# EAGLE schematic circuitdraft (EAGLE 9.5.1)
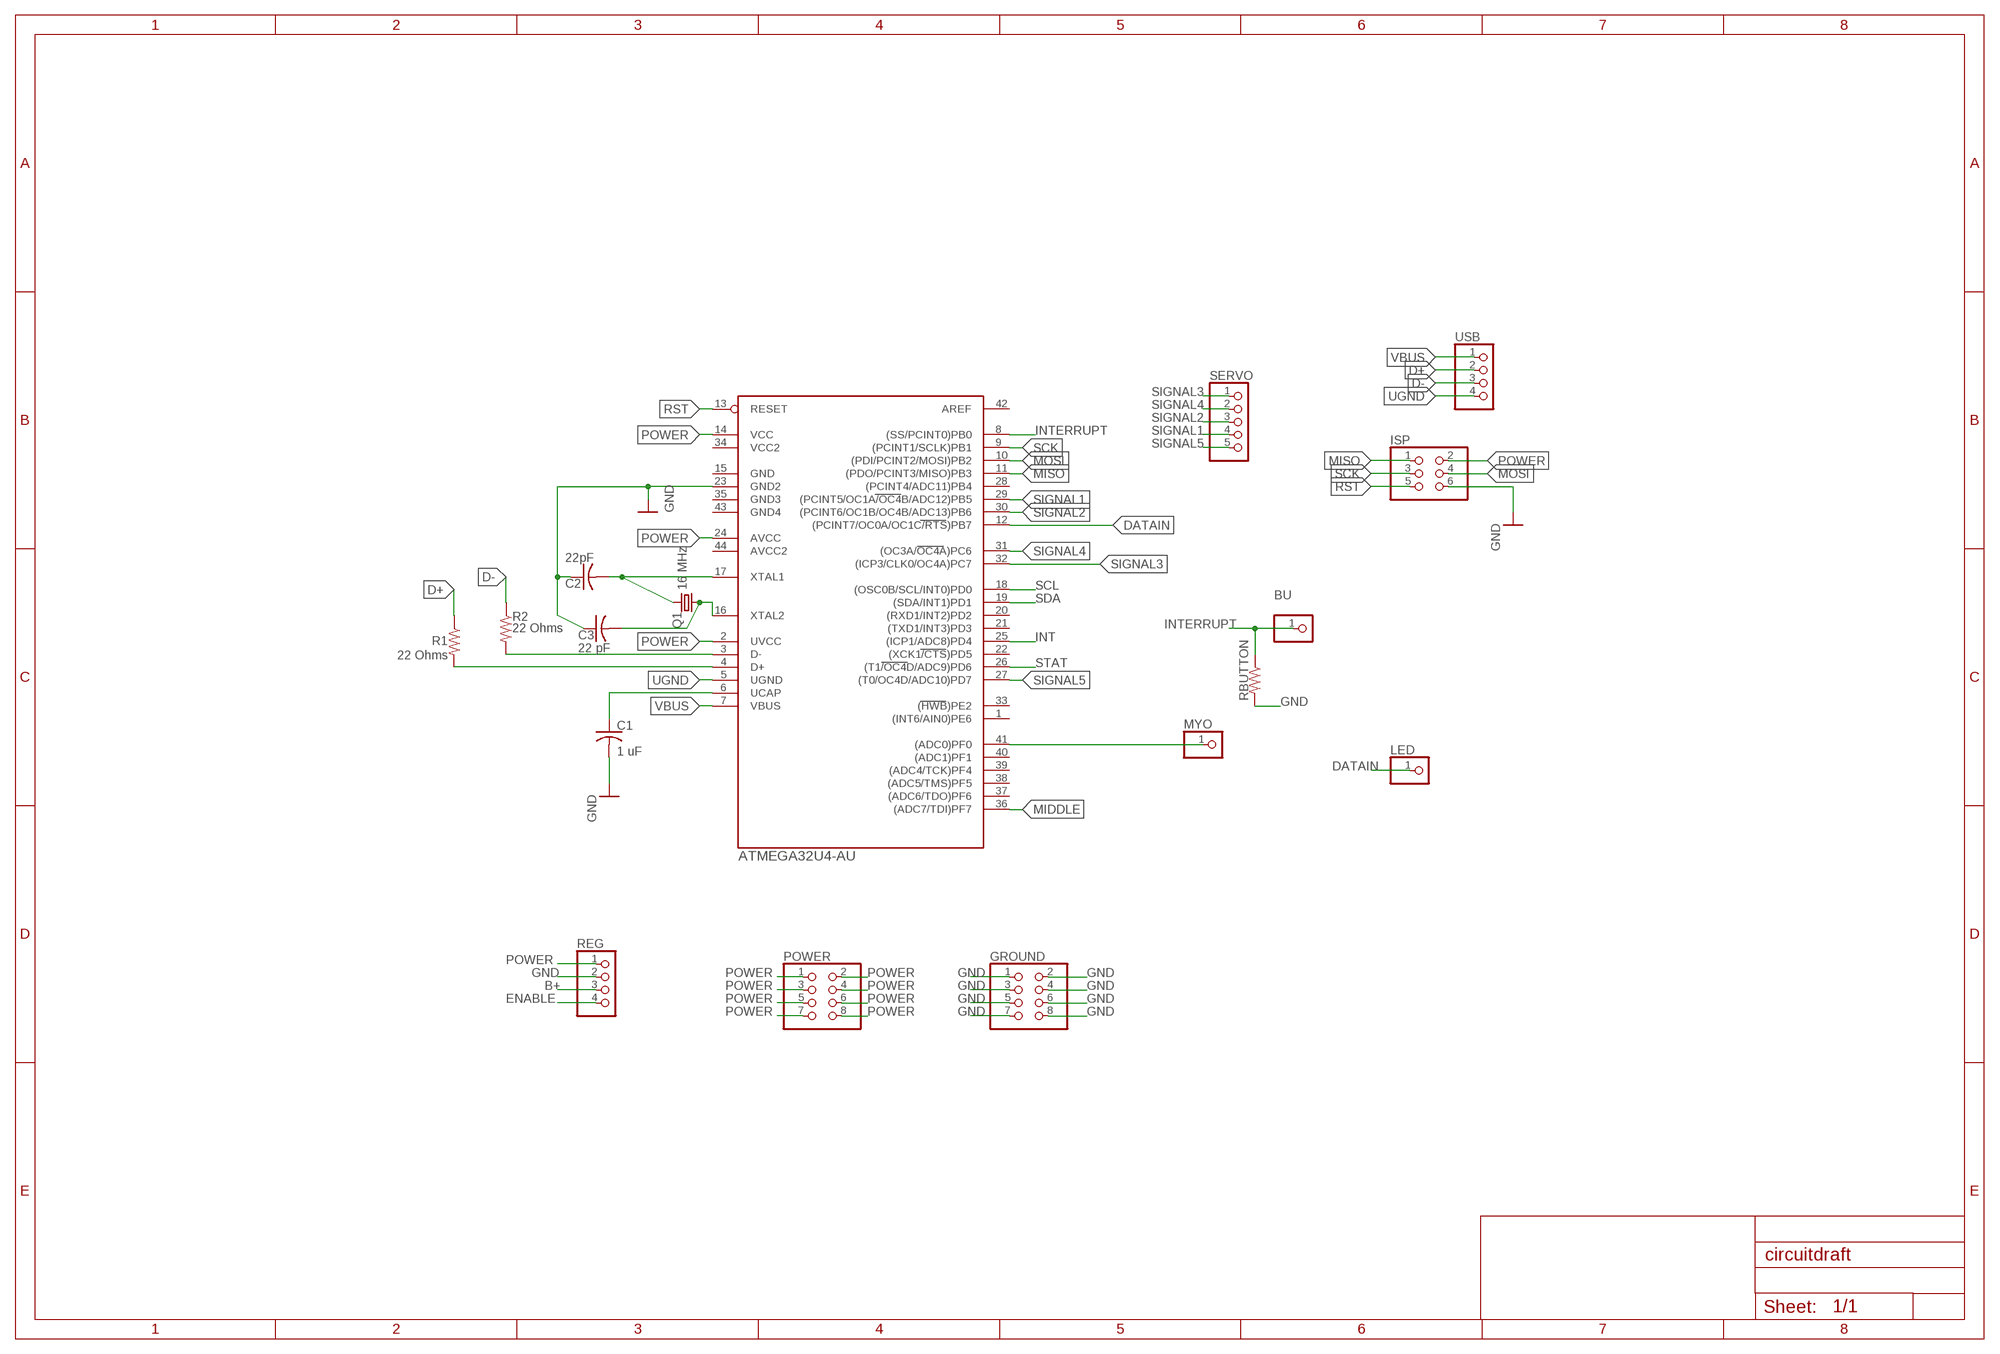
[diagram p0: schematic, sheet 1]

## Parts
BU  PINHD-1X1  [1X01]
C1  1 uF  C-USC0603  [C0603]
C2  22pF  C-USC0603  [C0603]
C3  22 pF  C-USC0603  [C0603]
GROUND  PINHD-2X4  [2X04]
ISP  PINHD-2X3  [2X03]
LED  PINHD-1X1  [1X01]
MYO  PINHD-1X1  [1X01]
POWER  PINHD-2X4  [2X04]
Q1  16 MHz  KX-5  [2.0X1.6_KX-5]
R1  22 Ohms  R-US_R0603  [R0603]
R2  22 Ohms  R-US_R0603  [R0603]
RBUTTON  220 Ohm  R-US_R0603  [R0603]
REG  PINHD-1X4  [1X04]
SERVO  PINHD-1X5  [1X05]
U$1  ATMEGA32U4-AU  [TQFP44]
USB  PINHD-1X4  [1X04]

## Nets
B+: REG.3
D+: R1.1 USB.2
D-: R2.1 USB.3
DATAIN: LED.1 U$1.12((PCINT7/OC0A/OC1C/RTS)PB7)
ENABLE: REG.4
GND: C1.2 C2.1 C3.1 GROUND.1 GROUND.2 GROUND.3 GROUND.4 GROUND.5 GROUND.6 GROUND.7 GROUND.8 ISP.6 RBUTTON.2 REG.2 U$1.23(GND2)
INT: U$1.25((ICP1/ADC8)PD4)
INTERRUPT: BU.1 RBUTTON.1 U$1.8((SS/PCINT0)PB0)
MIDDLE: U$1.36((ADC7/TDI)PF7)
MISO: ISP.1 U$1.11((PDO/PCINT3/MISO)PB3)
MOSI: ISP.4 U$1.10((PDI/PCINT2/MOSI)PB2)
MYOSIGNAL: MYO.1 U$1.41((ADC0)PF0)
N$2: R2.2 U$1.3(D-)
N$4: R1.2 U$1.4(D+)
N$5: C3.2 Q1.1 U$1.16(XTAL2)
N$6: C2.2 Q1.3 U$1.17(XTAL1)
N$8: C1.1 U$1.6(UCAP)
POWER: ISP.2 POWER.1 POWER.2 POWER.3 POWER.4 POWER.5 POWER.6 POWER.7 POWER.8 REG.1 U$1.2(UVCC) U$1.14(VCC) U$1.24(AVCC)
RST: ISP.5 U$1.13(RESET)
SCK: ISP.3 U$1.9((PCINT1/SCLK)PB1)
SCL: U$1.18((OSC0B/SCL/INT0)PD0)
SDA: U$1.19((SDA/INT1)PD1)
SIGNAL1: SERVO.4 U$1.29((PCINT5/OC1A/OC4B/ADC12)PB5)
SIGNAL2: SERVO.3 U$1.30((PCINT6/OC1B/OC4B/ADC13)PB6)
SIGNAL3: SERVO.1 U$1.32((ICP3/CLK0/OC4A)PC7)
SIGNAL4: SERVO.2 U$1.31((OC3A/OC4A)PC6)
SIGNAL5: SERVO.5 U$1.27((T0/OC4D/ADC10)PD7)
STAT: U$1.26((T1/OC4D/ADC9)PD6)
UGND: U$1.5(UGND) USB.4
VBUS: U$1.7(VBUS) USB.1
Unconnected: U$1.1((INT6/AIN0)PE6) U$1.15(GND) U$1.20((RXD1/INT2)PD2) U$1.21((TXD1/INT3)PD3) U$1.22((XCK1/CTS)PD5) U$1.28((PCINT4/ADC11)PB4) U$1.33((HWB)PE2) U$1.34(VCC2) U$1.35(GND3) U$1.37((ADC6/TDO)PF6) U$1.38((ADC5/TMS)PF5) U$1.39((ADC4/TCK)PF4) U$1.40((ADC1)PF1) U$1.42(AREF) U$1.43(GND4) U$1.44(AVCC2)

## Library data of the parts
BU LED MYO = pinhead:PINHD-1X1: PIN HEADER
C1-C3 = rcl:C-US: CAPACITOR, American symbol; SPICEPREFIX: C
GROUND POWER = pinhead:PINHD-2X4: PIN HEADER
ISP = pinhead:PINHD-2X3: PIN HEADER
Q1 = crystal-geyer_V1_0:KX: Quartz Crystals (MHz) SMD: KX - Serie Model Size l/w/h [mm] Frequency Range Frequency Stability Temp. Range [°C] Load Capacitance AECQ 200 availabel Datasheet KX-4 KX-5 KX-6 KX-7 KX-9A KX-9B KX-12A KX-12B KX-13 KX-20 KX-K KX-KS 1.6/1.2/0.3 2.0/1.6/0.45 2.5/2.0/0.55 3.2/2.5/0.8 5.0/3.2/1.0 5.0/3.2/1.1 6.0/3.5/1.1 6.0/3.5/1.0 7.0/5.0 /1.3 11.6/5.5/1.6 12.3/4.5/4.2 12.3/4.5/3.2 24.0 ~ 80.0 MHz 16.0 ~ 80.0 MHz 12.0 ~ 80.0 MHz 8.0 ~ 60.0 MHz 7,68 ~ 300,0 MHz 8,0 ~ 50,0 MHz 8,0 ~ 150,0 MHz 8,0 ~ 50,0 MHz 6,0 ~ 160,0 MHz 3,579 ~ 25,0 MHz 3,579 ~ 70,0 MHz 3,579 ~ 70,0 MHz ±10 … ±50ppm ±10 … ±50ppm ±10 … ±50ppm ±10 … ±50ppm ±10 … ±50ppm ±10 … ±50ppm ±10 … ±50ppm ±10 … ±50ppm ±10 … ±50ppm ±50ppm ±10 … ±50ppm ±10 … ±50ppm (*) -40°C …+85°C (*) -40°C …+125°C (*) -40°C …+125°C (*) -40°C …+125°C (*) -40°C …+105°C (*) -40°C …+105°C (*) -40°C …+125°C (*) -40°C …+105°C (*) -40°C …+105°C (*) -40°C …+105°C (*) -40°C …+85°C (*) -40°C …+85°C 8, 8…16 8, 8…16 10, 8…16 12, 7…20 16, 10…20 16, 10…20 16, 10…20 16, 12…20 16, 12…20 16, 12…20 16, 12…30 16, 12…30 - yes yes yes - - - - - - - - KX-4.pdf <http://www.geyer-electronic.de/uploads/tx_userartikelfrequenz/GEYER-KX-4.pdf> KX-5.pdf <http://www.geyer-electronic.de/uploads/tx_userartikelfrequenz/GEYER-KX-5.pdf> KX-6.pdf <http://www.geyer-electronic.de/uploads/tx_userartikelfrequenz/GEYER-KX-6.pdf> KX-7.pdf <http://www.geyer-electronic.de/uploads/tx_userartikelfrequenz/GEYER-KX-7.pdf> KX-9A.pdf <http://www.geyer-electronic.de/uploads/tx_userartikelfrequenz/GEYER-KX-9A.pdf> KX-9B.pdf <http://www.geyer-electronic.de/uploads/tx_userartikelfrequenz/GEYER-KX-9B.pdf> KX-12A.pdf <http://www.geyer-electronic.de/uploads/tx_userartikelfrequenz/GEYER-KX-12A.pdf> KX-12B.pdf <http://www.geyer-electronic.de/uploads/tx_userartikelfrequenz/GEYER-KX-12B.pdf> KX-13.pdf <http://www.geyer-electronic.de/uploads/tx_userartikelfrequenz/GEYER-KX-13.pdf> KX-20.pdf <http://www.geyer-electronic.de/uploads/tx_userartikelfrequenz/GEYER-KX-20.pdf> KX-K.pdf <http://www.geyer-electronic.de/uploads/tx_userartikelfrequenz/GEYER-KX-K.pdf> KX-KS.pdf <http://www.geyer-electronic.de/uploads/tx_userartikelfrequenz/GEYER-KX-KS.pdf> <http://www.geyer-electronic.de/fileadmin/template/img/logo-geyer-electronic.png> Details see: http://www.geyer-electronic.de/Frequenz-Produkte.9.0.html Created 2016-06-07, Hans Locher 2016 (C) Geyer Quartz Technology KX4,KX5,KX6,KX7,KX9A,KX9B,KX12A,KX12B,KX13,KX20,KXK,KXKS;1612;2016;2520;3225;5032;6035;7050;11655;12345;1,6x1,2;2,0x1,6;2,5x2,0;3,2x2,5;5,0x3,2;6,0x3,5;7,0x5,0;11,6x5,5;12,3x4,5;12,3x4,5;1.6x1.2;2.0x1.6;2.5x2.0;3.2x2.5;5.0x3.2;6.0x3.5;7.0x5.0;11.6x5.5;12.3x4.5;12.3x4.5;
R1 R2 RBUTTON = rcl:R-US_: RESISTOR, American symbol; SPICEPREFIX: R
REG USB = pinhead:PINHD-1X4: PIN HEADER
SERVO = pinhead:PINHD-1X5: PIN HEADER
U$1 = mega32U4:ATMEGA32U4-AU